# Altium schematic sheet 12V_Efuses2.SchDoc
size A4; SheetNumber: 4; SheetTotal: 5
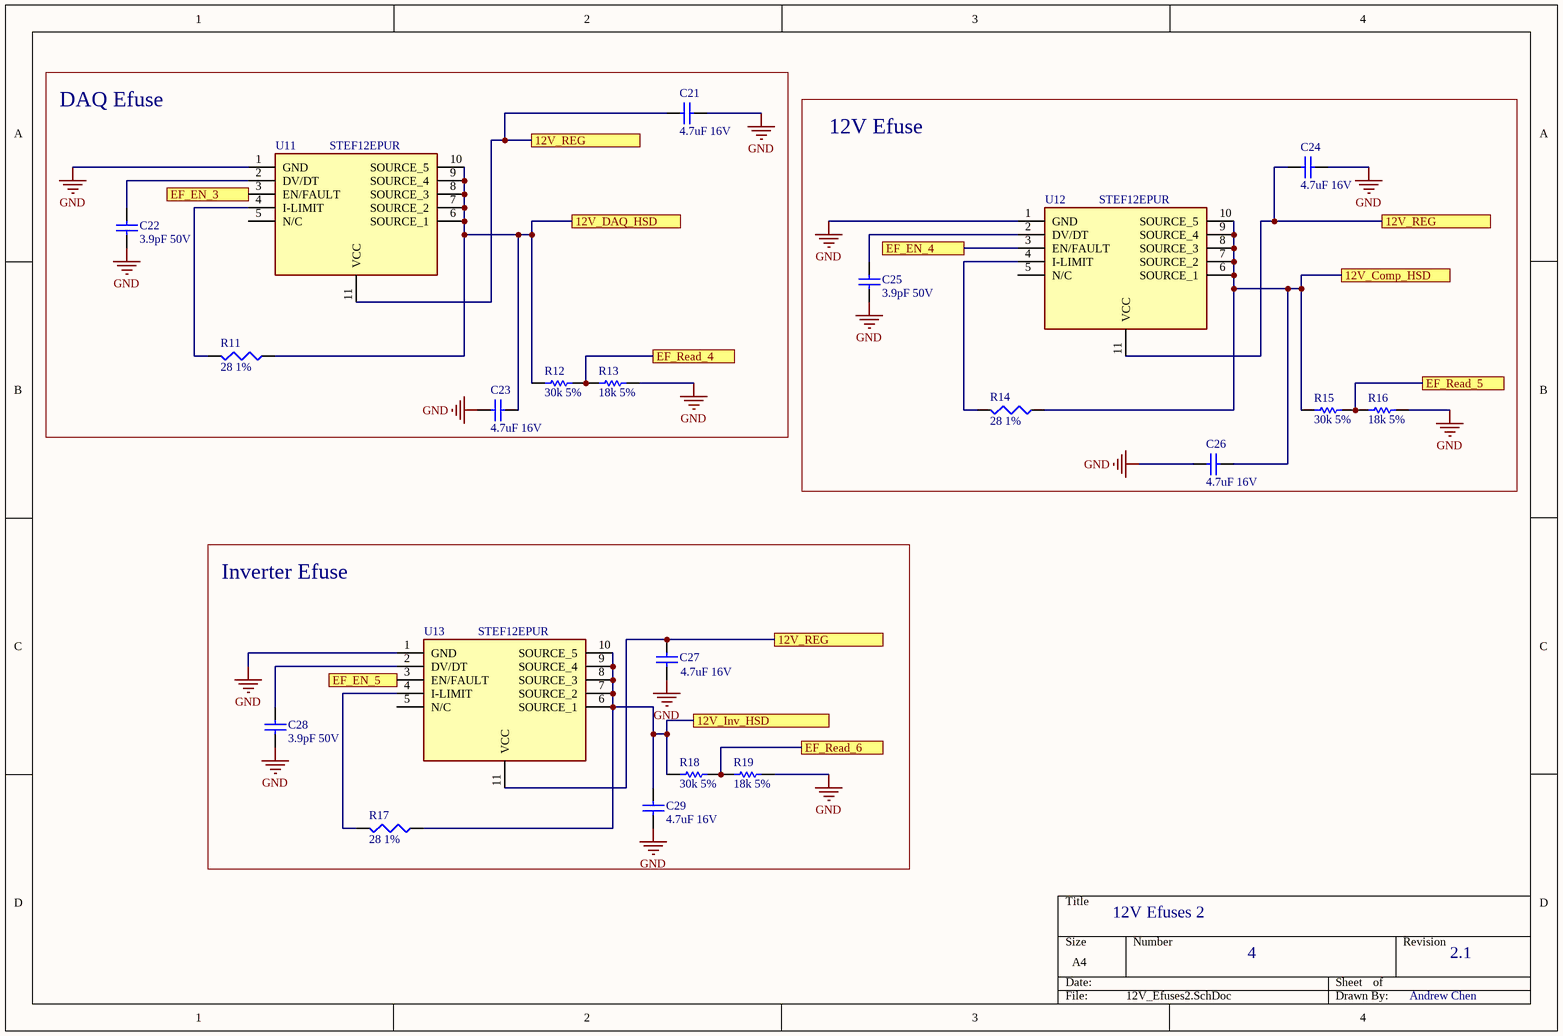
[diagram p0: 12V_Efuses2.SchDoc]

## Parts
C21  4.7uF 16V  [C1206]
C22  3.9pF 50V  [C1206]
C23  4.7uF 16V  [C1206]
C24  4.7uF 16V  [C1206]
C25  3.9pF 50V  [C1206]
C26  4.7uF 16V  [C1206]
C27  4.7uF 16V  [C1206]
C28  3.9pF 50V  [C1206]
C29  4.7uF 16V  [C1206]
R11  28 1%  [J1-0603]
R12  30k 5%  [RESC1609X50X30NL8T20]
R13  18k 5%  [RESC1609X50X30NL8T20]
R14  28 1%  [J1-0603]
R15  30k 5%  [RESC1609X50X30NL8T20]
R16  18k 5%  [RESC1609X50X30NL8T20]
R17  28 1%  [J1-0603]
R18  30k 5%  [RESC1609X50X30NL8T20]
R19  18k 5%  [RESC1609X50X30NL8T20]
U11  STEF12EPUR  [SON50P300X300X100-11N-D]
U12  STEF12EPUR  [SON50P300X300X100-11N-D]
U13  STEF12EPUR  [SON50P300X300X100-11N-D]

## Blocks framed on the sheet
DAQ Efuse: C21-C23 R11-R13 U11
12V Efuse: C24-C26 R14-R16 U12
Inverter Efuse: C27-C29 R17-R19 U13

## Ports
12V_Comp_HSD, 12V_DAQ_HSD, 12V_Inv_HSD, 12V_REG, EF_EN_3, EF_EN_4, EF_EN_5, EF_Read_4, EF_Read_5, EF_Read_6

## Nets
GND: C21.1 C22.2 C23.2 C24.1 C25.2 C26.2 C27.2 C28.2 C29.2 R13.2 R16.2 R19.2 U11.1(GND) U12.1(GND) U13.1(GND)
12V_Comp_HSD: C26.1 R14.1 R15.1 U12.6(SOURCE_1) U12.7(SOURCE_2) U12.8(SOURCE_3) U12.9(SOURCE_4) U12.10(SOURCE_5) ; port 12V_Comp_HSD
12V_DAQ_HSD: C23.1 R11.1 R12.1 U11.6(SOURCE_1) U11.7(SOURCE_2) U11.8(SOURCE_3) U11.9(SOURCE_4) U11.10(SOURCE_5) ; port 12V_DAQ_HSD
12V_Inv_HSD: C29.1 R17.1 R18.1 U13.6(SOURCE_1) U13.7(SOURCE_2) U13.8(SOURCE_3) U13.9(SOURCE_4) U13.10(SOURCE_5) ; port 12V_Inv_HSD
12V_REG: C21.2 C24.2 C27.1 U11.11(VCC) U12.11(VCC) U13.11(VCC) ; port 12V_REG
EF_EN_3: U11.3(EN/FAULT) ; port EF_EN_3
EF_EN_4: U12.3(EN/FAULT) ; port EF_EN_4
EF_EN_5: U13.3(EN/FAULT) ; port EF_EN_5
EF_Read_4: R12.2 R13.1 ; port EF_Read_4
EF_Read_5: R15.2 R16.1 ; port EF_Read_5
EF_Read_6: R18.2 R19.1 ; port EF_Read_6
NetC22_1: C22.1 U11.2(DV/DT)
NetC25_1: C25.1 U12.2(DV/DT)
NetC28_1: C28.1 U13.2(DV/DT)
NetR11_2: R11.2 U11.4(I-LIMIT)
NetR14_2: R14.2 U12.4(I-LIMIT)
NetR17_2: R17.2 U13.4(I-LIMIT)

Not connected (* = marked no-connect by the designer): U11 5(N/C); U12 5(N/C); U13 5(N/C)

## Notes on the sheet
- 12V Efuses 2
- 4
- 2.1
- Andrew Chen

## Library data of the parts
C21-C29 = Cap Semi: Capacitor (Semiconductor SIM Model); Value: 22pF; Published: 8-Jun-2000; LatestRevisionDate: 29-May-2009; LatestRevisionNote: IPC-7351 Footprint Added.; PackageReference: C1206; Publisher: Altium Limited; PackageDescription: Chip Capacitor
R11 R14 R17 = Res3: Resistor; Value: 220; Published: 8-Jun-2000; LatestRevisionDate: 29-May-2009; LatestRevisionNote: IPC-7351 Footprint Added.; PackageReference: J1-0603; Publisher: Altium Limited; PackageDescription: Chip Resistor
R12 R13 R15 R16 R18 R19 = CMP-2000-03816-5: CRCW06030000Z0EA; Manufacturer: Vishay Semiconductor; Voltage Rating: 75 V; Package Quantity: 5000; DatasheetVersion: 06/2012; Min Operating Temperature: -55 degC; ComponentLink1URL: http://www.vishay.com/; Mounting Technology: Surface Mount; Height: 0.45 mm; ComponentLink1Description: Manufacturer URL; REACH SVHC: Unknown; PackageReference: 0603; Packaging: Tape and Reel; Max Operating Temperature: 155 degC; Mount: Surface Mount; ComponentLink2Description: Datasheet; PackageDescription: 2-Pin Surface Mount Device, Body 1.575 x 0.85 mm; Length: 1.55 mm; ComponentLink2URL: http://www.vishay.com/docs/20035/dcrcwe3.pdf; Pins: 2; RoHSCompliant: true
U11-U13 = STEF12EPUR: Integrated Circuit; Manufacturer_Name: STMicroelectronics; Datasheet Link: https://www.arrow.com/en/products/stef12epur/stmicroelectronics; Height: 1mm; Manufacturer_Part_Number: STEF12EPUR; Mouser Part Number: 511-STEF12EPUR; Mouser Price/Stock: https://www.mouser.co.uk/ProductDetail/STMicroelectronics/STEF12EPUR?qs=mKNKSX85ZJfL9n%252BG1BPmuw%3D%3D; Arrow Part Number: STEF12EPUR; Arrow Price/Stock: https://www.arrow.com/en/products/stef12epur/stmicroelectronics